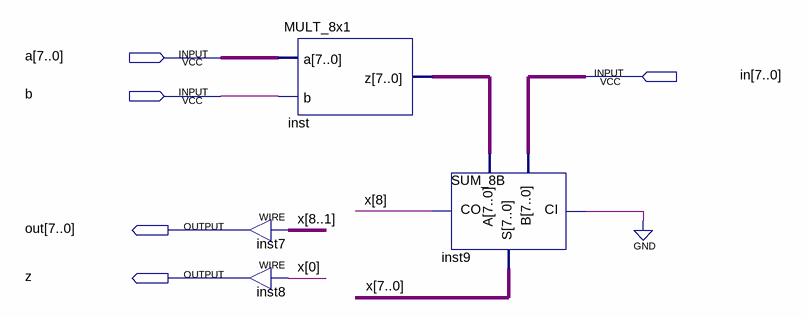
[diagram p0: schematic sheet]
// Quartus schematic MULT_ACC.bdf as structural Verilog: 4 symbols, 5 pins
module MULT_ACC (
  input  [7:0] a,
  input  [7:0] in,
  input  b,
  output [7:0] out,
  output z
);

  wire [7:0] inst_z;
  wire [8:0] x;

  MULT_8x1 inst (.a(a), .b(b), .z(inst_z));
  assign out = x[8:1];  // WIRE inst7
  assign z = x[0];  // WIRE inst8
  SUM_8B inst9 (.A(inst_z), .B(in), .CI(1'b0), .S(x[7:0]), .CO(x[8]));
endmodule
